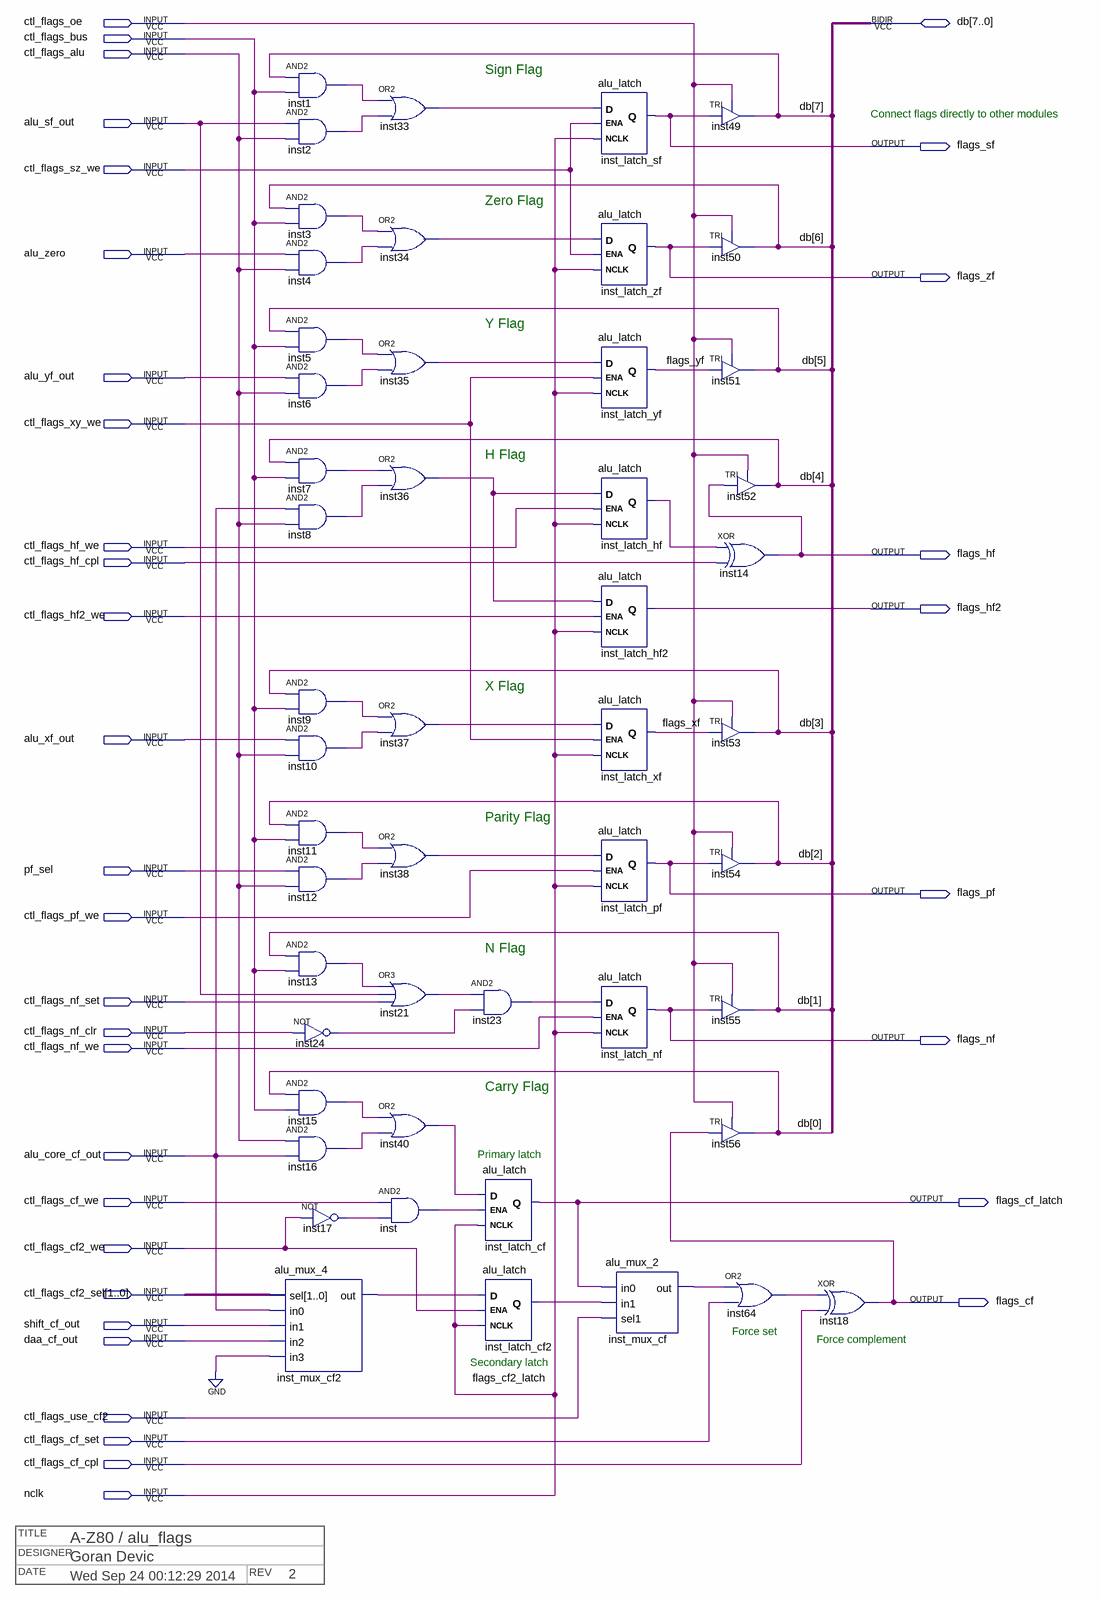
[diagram p0: schematic sheet]
// Quartus schematic alu_flags.bdf as structural Verilog: 50 symbols, 36 pins
// Title block: DATE: Wed Sep 24 00:12:29 2014; DESIGNER: Goran Devic; REV: 2; TITLE: A-Z80 / alu_flags
module alu_flags (
  input  ctl_flags_oe,
  input  ctl_flags_bus,
  input  ctl_flags_alu,
  input  alu_sf_out,
  input  ctl_flags_sz_we,
  input  alu_zero,
  input  alu_yf_out,
  input  ctl_flags_xy_we,
  input  ctl_flags_hf_we,
  input  ctl_flags_hf_cpl,
  input  ctl_flags_hf2_we,
  input  alu_xf_out,
  input  pf_sel,
  input  ctl_flags_pf_we,
  input  ctl_flags_nf_set,
  input  ctl_flags_nf_clr,
  input  ctl_flags_nf_we,
  input  alu_core_cf_out,
  input  ctl_flags_cf_we,
  input  ctl_flags_cf2_we,
  input  [1:0] ctl_flags_cf2_sel,
  input  shift_cf_out,
  input  daa_cf_out,
  input  ctl_flags_use_cf2,
  input  ctl_flags_cf_set,
  input  ctl_flags_cf_cpl,
  input  nclk,
  inout  [7:0] db,
  output flags_sf,
  output flags_zf,
  output flags_hf,
  output flags_hf2,
  output flags_pf,
  output flags_nf,
  output flags_cf_latch,
  output flags_cf
);

  wire flags_cf2_latch, flags_xf, flags_yf, inst1_out, inst2_out, inst3_out, inst4_out, inst5_out, inst6_out,
       inst7_out, inst8_out, inst9_out, inst10_out, inst11_out, inst12_out, inst13_out, inst15_out,
       inst16_out, inst17_out, inst21_out, inst23_out, inst24_out, inst33_out, inst34_out, inst35_out,
       inst36_out, inst37_out, inst38_out, inst40_out, inst64_out, inst_latch_hf_q, inst_mux_cf2_out,
       inst_mux_cf_out, inst_out;

  and inst1 (inst1_out, db[7], ctl_flags_bus);
  and inst2 (inst2_out, alu_sf_out, ctl_flags_alu);
  and inst3 (inst3_out, db[6], ctl_flags_bus);
  and inst4 (inst4_out, alu_zero, ctl_flags_alu);
  and inst5 (inst5_out, db[5], ctl_flags_bus);
  and inst6 (inst6_out, alu_yf_out, ctl_flags_alu);
  and inst7 (inst7_out, db[4], ctl_flags_bus);
  and inst8 (inst8_out, alu_core_cf_out, ctl_flags_alu);
  and inst9 (inst9_out, db[3], ctl_flags_bus);
  and inst10 (inst10_out, alu_xf_out, ctl_flags_alu);
  and inst11 (inst11_out, db[2], ctl_flags_bus);
  and inst12 (inst12_out, pf_sel, ctl_flags_alu);
  and inst13 (inst13_out, db[1], ctl_flags_bus);
  not inst24 (inst24_out, ctl_flags_nf_clr);
  and inst15 (inst15_out, db[0], ctl_flags_bus);
  and inst16 (inst16_out, ctl_flags_alu, alu_core_cf_out);
  alu_mux_4 inst_mux_cf2 (
    .sel(ctl_flags_cf2_sel), .in0(alu_core_cf_out), .in1(shift_cf_out), .in2(daa_cf_out), .in3(1'b0),
    .out(inst_mux_cf2_out));
  not inst17 (inst17_out, ctl_flags_cf2_we);
  or inst33 (inst33_out, inst1_out, inst2_out);
  or inst34 (inst34_out, inst3_out, inst4_out);
  or inst35 (inst35_out, inst5_out, inst6_out);
  or inst36 (inst36_out, inst7_out, inst8_out);
  or inst37 (inst37_out, inst9_out, inst10_out);
  or inst38 (inst38_out, inst11_out, inst12_out);
  or inst21 (inst21_out, inst13_out, alu_sf_out, ctl_flags_nf_set);
  or inst40 (inst40_out, inst15_out, inst16_out);
  and inst (inst_out, ctl_flags_cf_we, inst17_out);
  and inst23 (inst23_out, inst21_out, inst24_out);
  alu_latch inst_latch_cf (.D(inst40_out), .ENA(inst_out), .NCLK(nclk), .Q(flags_cf_latch));
  alu_latch inst_latch_cf2 (.D(inst_mux_cf2_out), .ENA(ctl_flags_cf2_we), .NCLK(nclk), .Q(flags_cf2_latch));
  alu_latch inst_latch_sf (.D(inst33_out), .ENA(ctl_flags_sz_we), .NCLK(nclk), .Q(flags_sf));
  alu_latch inst_latch_zf (.D(inst34_out), .ENA(ctl_flags_sz_we), .NCLK(nclk), .Q(flags_zf));
  alu_latch inst_latch_yf (.D(inst35_out), .ENA(ctl_flags_xy_we), .NCLK(nclk), .Q(flags_yf));
  alu_latch inst_latch_hf (.D(inst36_out), .ENA(ctl_flags_hf_we), .NCLK(nclk), .Q(inst_latch_hf_q));
  alu_latch inst_latch_hf2 (.D(inst36_out), .ENA(ctl_flags_hf2_we), .NCLK(nclk), .Q(flags_hf2));
  alu_latch inst_latch_xf (.D(inst37_out), .ENA(ctl_flags_xy_we), .NCLK(nclk), .Q(flags_xf));
  alu_latch inst_latch_pf (.D(inst38_out), .ENA(ctl_flags_pf_we), .NCLK(nclk), .Q(flags_pf));
  alu_latch inst_latch_nf (.D(inst23_out), .ENA(ctl_flags_nf_we), .NCLK(nclk), .Q(flags_nf));
  alu_mux_2 inst_mux_cf (.in0(flags_cf_latch), .in1(flags_cf2_latch), .sel1(ctl_flags_use_cf2), .out(inst_mux_cf_out));
  TRI inst49 (.IN(flags_sf), .OE(ctl_flags_oe), .OUT(db[7]));
  TRI inst50 (.IN(flags_zf), .OE(ctl_flags_oe), .OUT(db[6]));
  TRI inst51 (.IN(flags_yf), .OE(ctl_flags_oe), .OUT(db[5]));
  TRI inst52 (.IN(flags_hf), .OE(ctl_flags_oe), .OUT(db[4]));
  xor inst14 (flags_hf, inst_latch_hf_q, ctl_flags_hf_cpl);
  TRI inst53 (.IN(flags_xf), .OE(ctl_flags_oe), .OUT(db[3]));
  TRI inst54 (.IN(flags_pf), .OE(ctl_flags_oe), .OUT(db[2]));
  TRI inst55 (.IN(flags_nf), .OE(ctl_flags_oe), .OUT(db[1]));
  TRI inst56 (.IN(flags_cf), .OE(ctl_flags_oe), .OUT(db[0]));
  or inst64 (inst64_out, inst_mux_cf_out, ctl_flags_cf_set);
  xor inst18 (flags_cf, inst64_out, ctl_flags_cf_cpl);

  // Notes on the sheet:
  //   Sign Flag
  //   Connect flags directly to other modules
  //   Zero Flag
  //   Y Flag
  //   H Flag
  //   X Flag
  //   Parity Flag
  //   N Flag
  //   Carry Flag
  //   Primary latch
  //   Force set
  //   Force complement
  //   Secondary latch
endmodule
